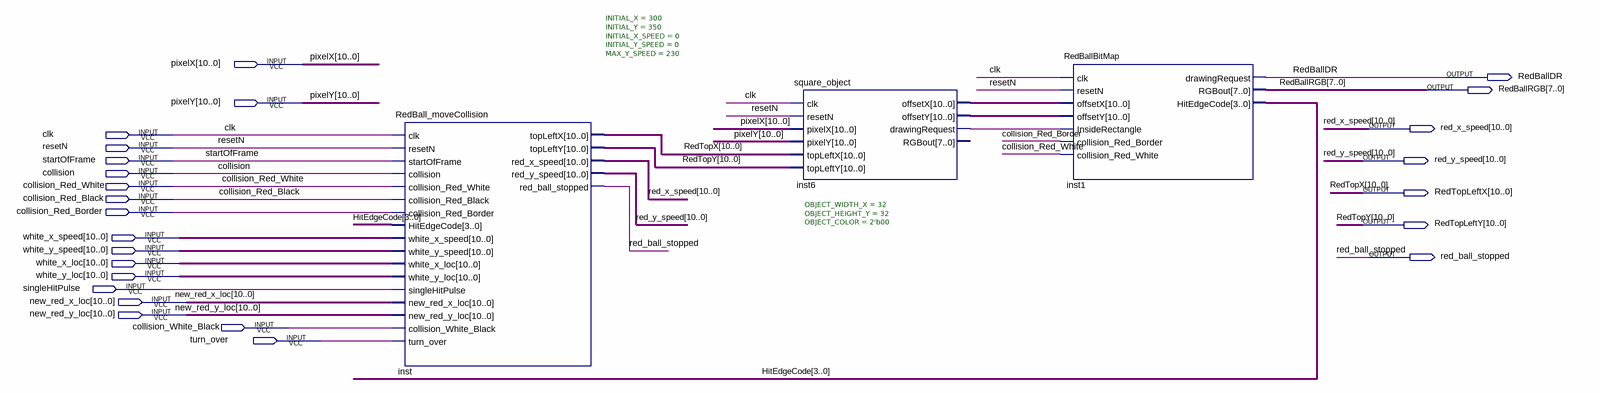
[diagram p0: schematic sheet]
// Quartus schematic RedBallBlock.bdf as structural Verilog: 3 symbols, 25 pins
module RedBallBlock (
  input  [10:0] pixelX,
  input  [10:0] pixelY,
  input  clk,
  input  resetN,
  input  startOfFrame,
  input  collision,
  input  collision_Red_White,
  input  collision_Red_Black,
  input  collision_Red_Border,
  input  [10:0] white_x_speed,
  input  [10:0] white_y_speed,
  input  [10:0] white_x_loc,
  input  [10:0] white_y_loc,
  input  singleHitPulse,
  input  [10:0] new_red_x_loc,
  input  [10:0] new_red_y_loc,
  input  collision_White_Black,
  input  turn_over,
  output RedBallDR,
  output [7:0] RedBallRGB,
  output [10:0] red_x_speed,
  output [10:0] red_y_speed,
  output [10:0] RedTopLeftX,
  output [10:0] RedTopLeftY,
  output red_ball_stopped
);

  wire inst6_drawingrequest;
  wire [3:0] HitEdgeCode;
  wire [10:0] inst6_offsetx, inst6_offsety;

  RedBall_moveCollision #(.INITIAL_X(300), .INITIAL_Y(350), .INITIAL_X_SPEED(0), .INITIAL_Y_SPEED(0), .MAX_Y_SPEED(230)) inst (
    .clk(clk), .resetN(resetN), .startOfFrame(startOfFrame), .collision(collision),
    .collision_Red_White(collision_Red_White), .collision_Red_Black(collision_Red_Black),
    .collision_Red_Border(collision_Red_Border), .HitEdgeCode(HitEdgeCode), .white_x_speed(white_x_speed),
    .white_y_speed(white_y_speed), .white_x_loc(white_x_loc), .white_y_loc(white_y_loc),
    .singleHitPulse(singleHitPulse), .new_red_x_loc(new_red_x_loc), .new_red_y_loc(new_red_y_loc),
    .collision_White_Black(collision_White_Black), .turn_over(turn_over), .topLeftX(RedTopLeftX),
    .topLeftY(RedTopLeftY), .red_x_speed(red_x_speed), .red_y_speed(red_y_speed),
    .red_ball_stopped(red_ball_stopped));
  square_object #(.OBJECT_WIDTH_X(32), .OBJECT_HEIGHT_Y(32), .OBJECT_COLOR(2'b00)) inst6 (
    .clk(clk), .resetN(resetN), .pixelX(pixelX), .pixelY(pixelY), .topLeftX(RedTopLeftX),
    .topLeftY(RedTopLeftY), .offsetX(inst6_offsetx), .offsetY(inst6_offsety),
    .drawingRequest(inst6_drawingrequest));  // open: RGBout
  RedBallBitMap inst1 (
    .clk(clk), .resetN(resetN), .offsetX(inst6_offsetx), .offsetY(inst6_offsety),
    .InsideRectangle(inst6_drawingrequest), .collision_Red_Border(collision_Red_Border),
    .collision_Red_White(collision_Red_White), .drawingRequest(RedBallDR), .RGBout(RedBallRGB),
    .HitEdgeCode(HitEdgeCode));

  // Other names for the same wires on the sheet: RedTopX[10:0] = RedTopLeftX; RedTopY[10:0] = RedTopLeftY
endmodule
